# EasyEDA schematic SCH_Schematic_Smart-agriculture-monitoring-system_2025-07-10.json
TITLE: Smart Agriculture Monitoring System; REV: 1.0; Date: 2025-07-10; Sheet: 1/1; Drawn By: abhishek.skit.work
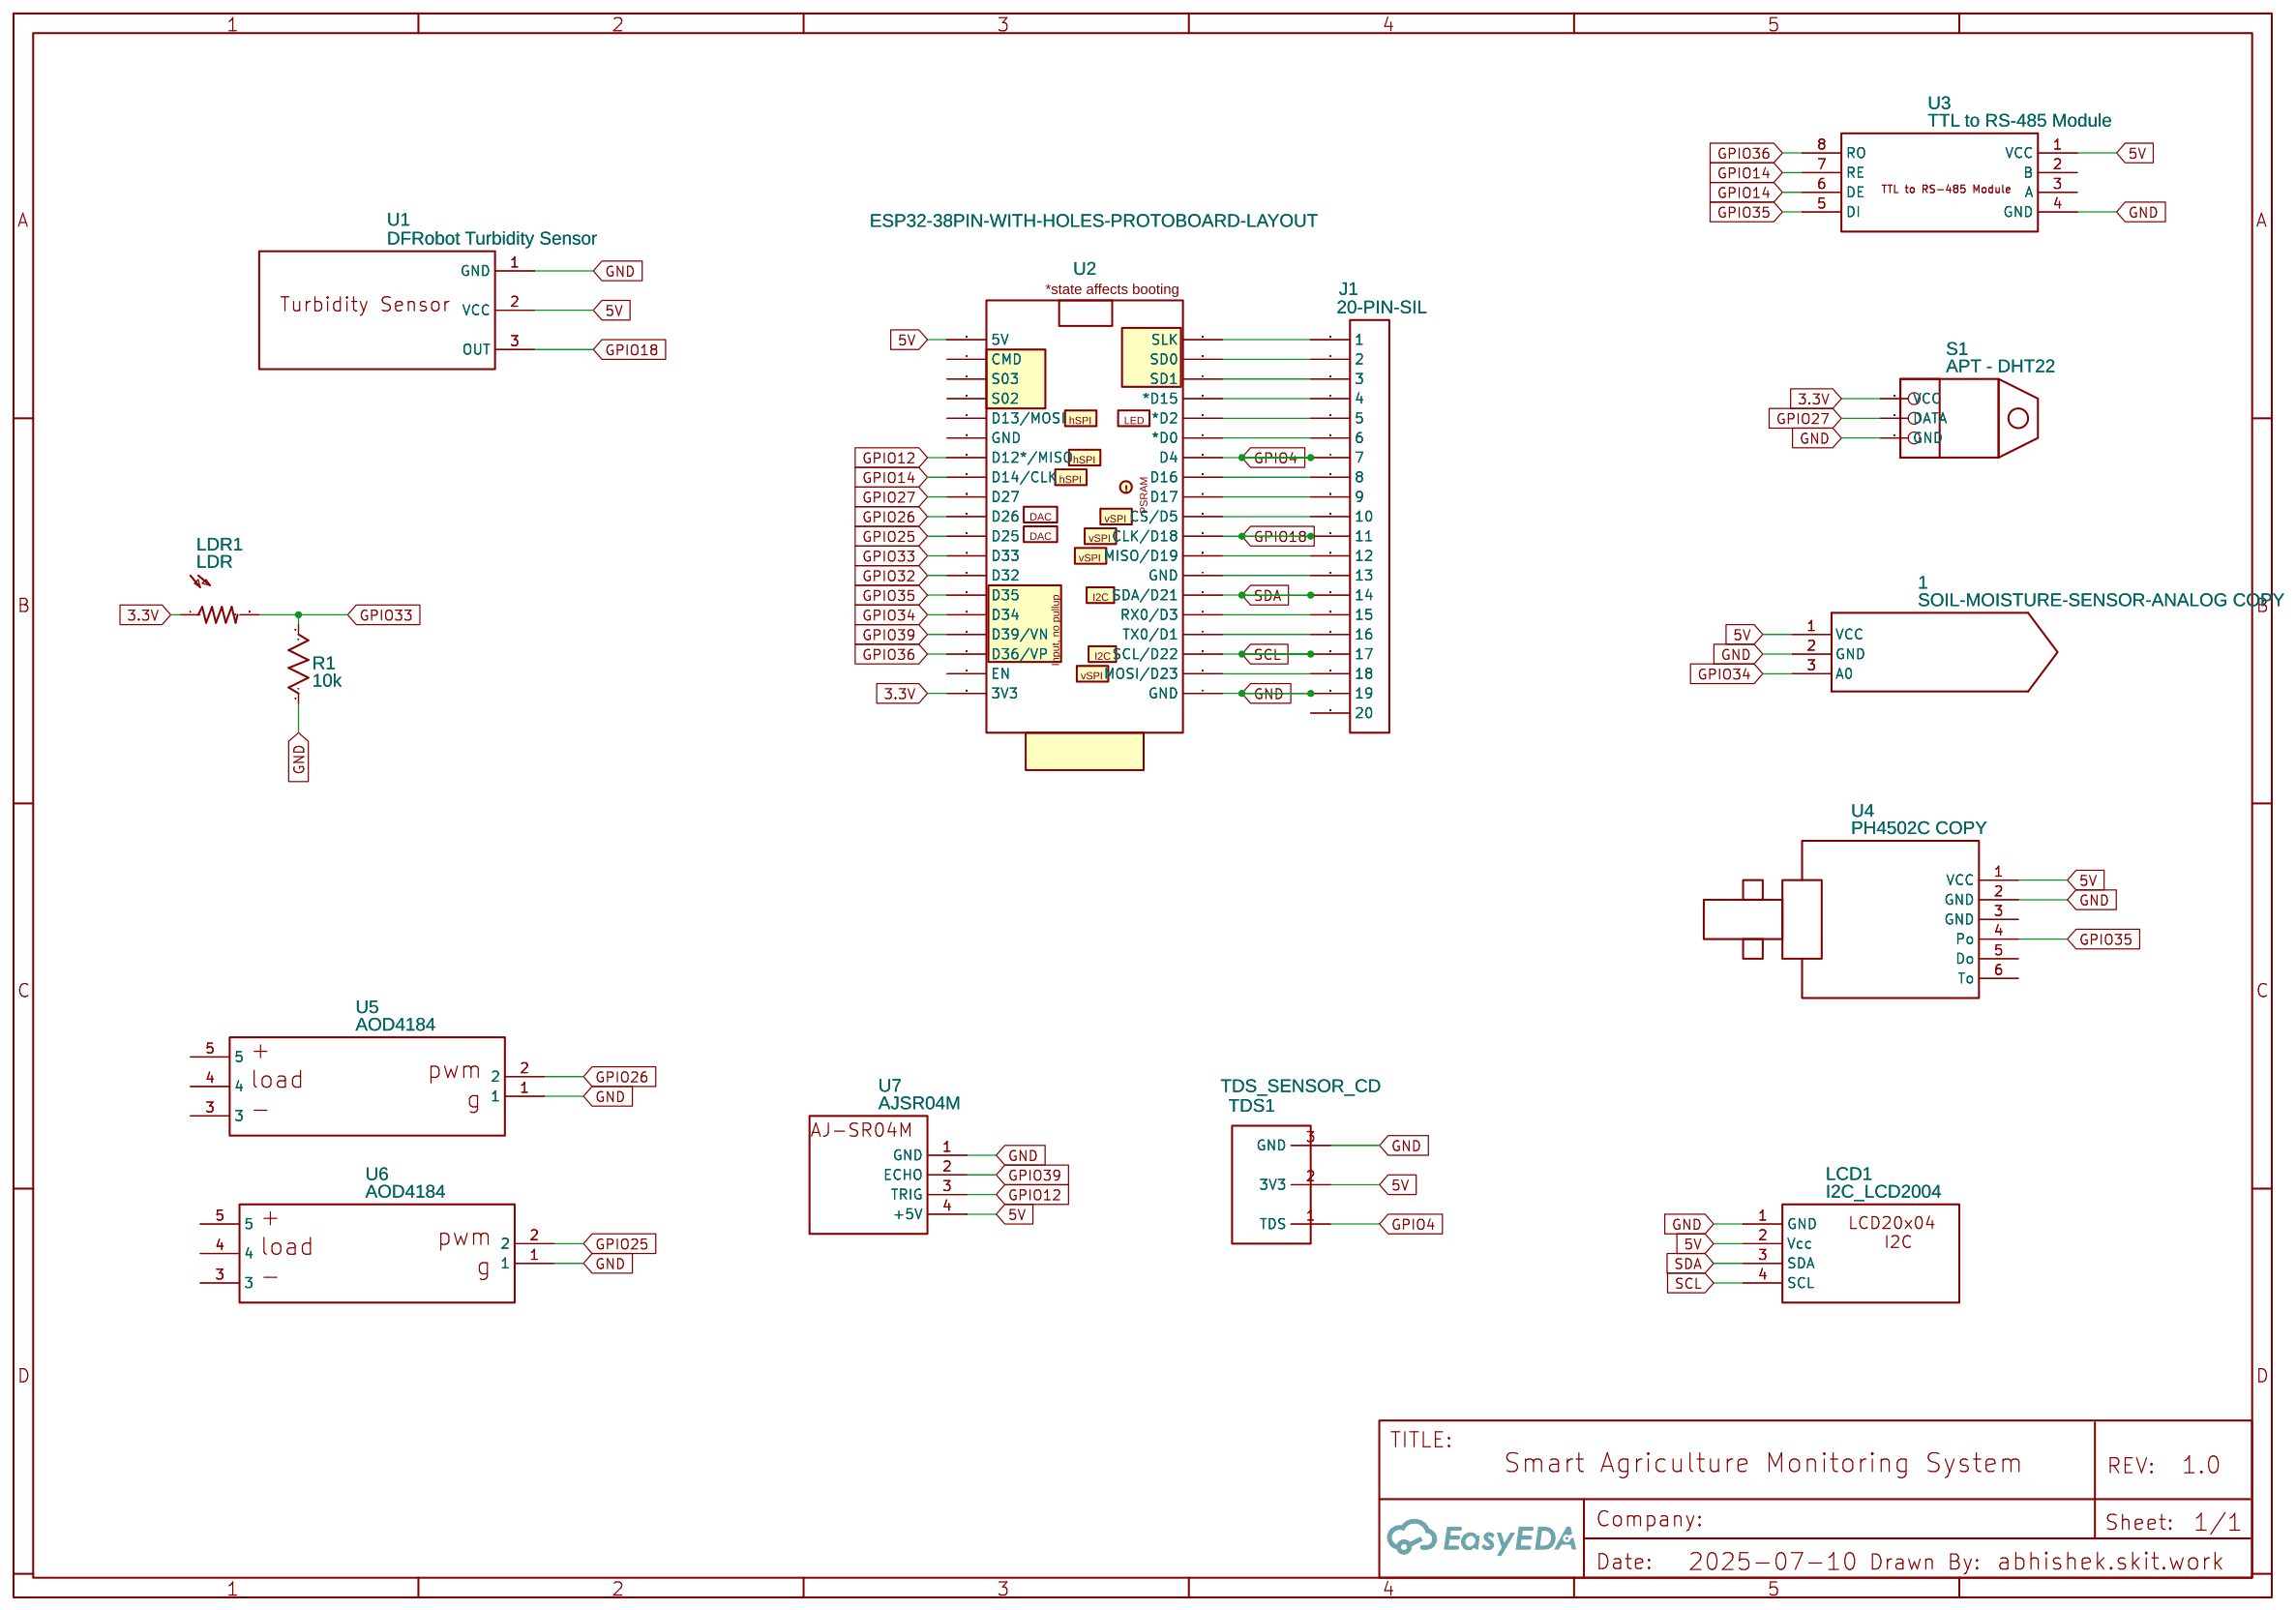
[diagram p0: schematic sheet]

## Parts
1  SOIL-MOISTURE-SENSOR-ANALOG COPY  [SOIL-MOISTURE-SENSOR]
J1  20-PIN-SIL  [20-PIN-SIL]
LCD1  I2C_LCD2004  [I2C_LCD2004]
LDR1  LDR  [LDR (LDRSC058S)]
R1  10k  [R0805]
S1  APT - DHT22  [DHT22]
TDS1  TDS_SENSOR_CD  [TDS_SENSOR_CD]
U1  DFRobot Turbidity Sensor  [DFROBOT TURBIDITY SENSOR]
U2  ESP32-38PIN-WITH-HOLES-PROTOBOARD-LAYOUT  [ESP32-38PIN-WITH-HOLES-PROTOBOARD-READABLE]
U3  TTL to RS-485 Module  [TTL TO RS-485 MODULE]
U4  PH4502C COPY  [PH4502C COPY]
U5  AOD4184  [AOD4184]
U6  AOD4184  [AOD4184]
U7  AJSR04M  [AJ-SR04M]

## Library data of the parts
1 = SOIL-MOISTURE-SENSOR-ANALOG COPY: Contributor: Łukasz Danilewicz
J1 = 20-PIN-SIL: Contributor: cpu76239
LCD1 = I2C_LCD2004: Contributor: tomek.langer; Manufacturer: Various
LDR1 = LDR: Contributor: braislp
R1 = R_0805_US: Contributor: LCEDA_Lib
S1 = APT - DHT22: Contributor: Swade C
TDS1 = TDS_SENSOR_CD: Contributor: Ostap Ostap
U1 = DFRobot Turbidity Sensor: Supplier: DFRobot; Contributor: anandj
U2 = ESP32-38PIN-WITH-HOLES-PROTOBOARD-LAYOUT: Contributor: jhonathan0310030; Package Display: No
U3 = TTL to RS-485 Module: Contributor: Roberto Gomes
U4 = PH4502C COPY: Manufacturer Part: Pre-Assembled Female BNC; Contributor: bybbo 8bit; link: https://www.atlas-scientific.com/product_pages/components/bnc.html
U5 U6 = AOD4184: Contributor: danger21th
U7 = AJSR04M: Contributor: ayhanugur

## Nets
3.3V: LDR1.1 S1.1(VCC) U2.38(3V3)
5V: 1.1(VCC) LCD1.2(Vcc) TDS1.2(3V3) U1.2(VCC) U2.20(5V) U3.1(VCC) U4.1(VCC) U7.4(+5V)
GND: 1.2(GND) J1.19 LCD1.1(GND) R1.1 S1.3(GND) TDS1.3(GND) U1.1(GND) U2.1(GND) U3.4(GND) U4.2(GND) U5.1 U6.1 U7.1(GND)
GPIO4: J1.7 TDS1.1(TDS) U2.13(D4)
GPIO12: U2.26(D12*/MISO) U7.3(TRIG)
GPIO14: U2.27(D14/CLK) U3.6(DE) U3.7(RE)
GPIO18: J1.11 U1.3(OUT) U2.9(CLK/D18)
GPIO25: U2.30(D25) U6.2
GPIO26: U2.29(D26) U5.2
GPIO27: S1.2(DATA) U2.28(D27)
GPIO32: U2.32(D32)
GPIO33: LDR1.2 R1.2 U2.31(D33)
GPIO34: 1.3(A0) U2.34(D34)
GPIO35: U2.33(D35) U3.5(DI) U4.4(Po)
GPIO36: U2.36(D36/VP) U3.8(RO)
GPIO39: U2.35(D39/VN) U7.2(ECHO)
SCL: J1.17 LCD1.4(SCL) U2.3(SCL/D22)
SDA: J1.14 LCD1.3(SDA) U2.6(SDA/D21)
Net-(J1-1): J1.1 U2.19(SLK)
Net-(J1-2): J1.2 U2.18(SD0)
Net-(J1-3): J1.3 U2.17(SD1)
Net-(J1-4): J1.4 U2.16(*D15)
Net-(J1-5): J1.5 U2.15(*D2)
Net-(J1-6): J1.6 U2.14(*D0)
Net-(J1-8): J1.8 U2.12(D16)
Net-(J1-9): J1.9 U2.11(D17)
Net-(J1-10): J1.10 U2.10(CS/D5)
Net-(J1-12): J1.12 U2.8(MISO/D19)
Net-(J1-13): J1.13 U2.7(GND)
Net-(J1-15): J1.15 U2.5(RX0/D3)
Net-(J1-16): J1.16 U2.4(TX0/D1)
Net-(J1-18): J1.18 U2.2(MOSI/D23)

Not connected (* = marked no-connect by the designer): J1 20; U2 21(CMD) 22(S03) 23(S02) 24(D13/MOSI) 25(GND) 37(EN); U3 2(B) 3(A); U4 3(GND) 5(Do) 6(To); U5 3 4 5; U6 3 4 5
